# Altium schematic sheet Bluetooth.SchDoc
size A3
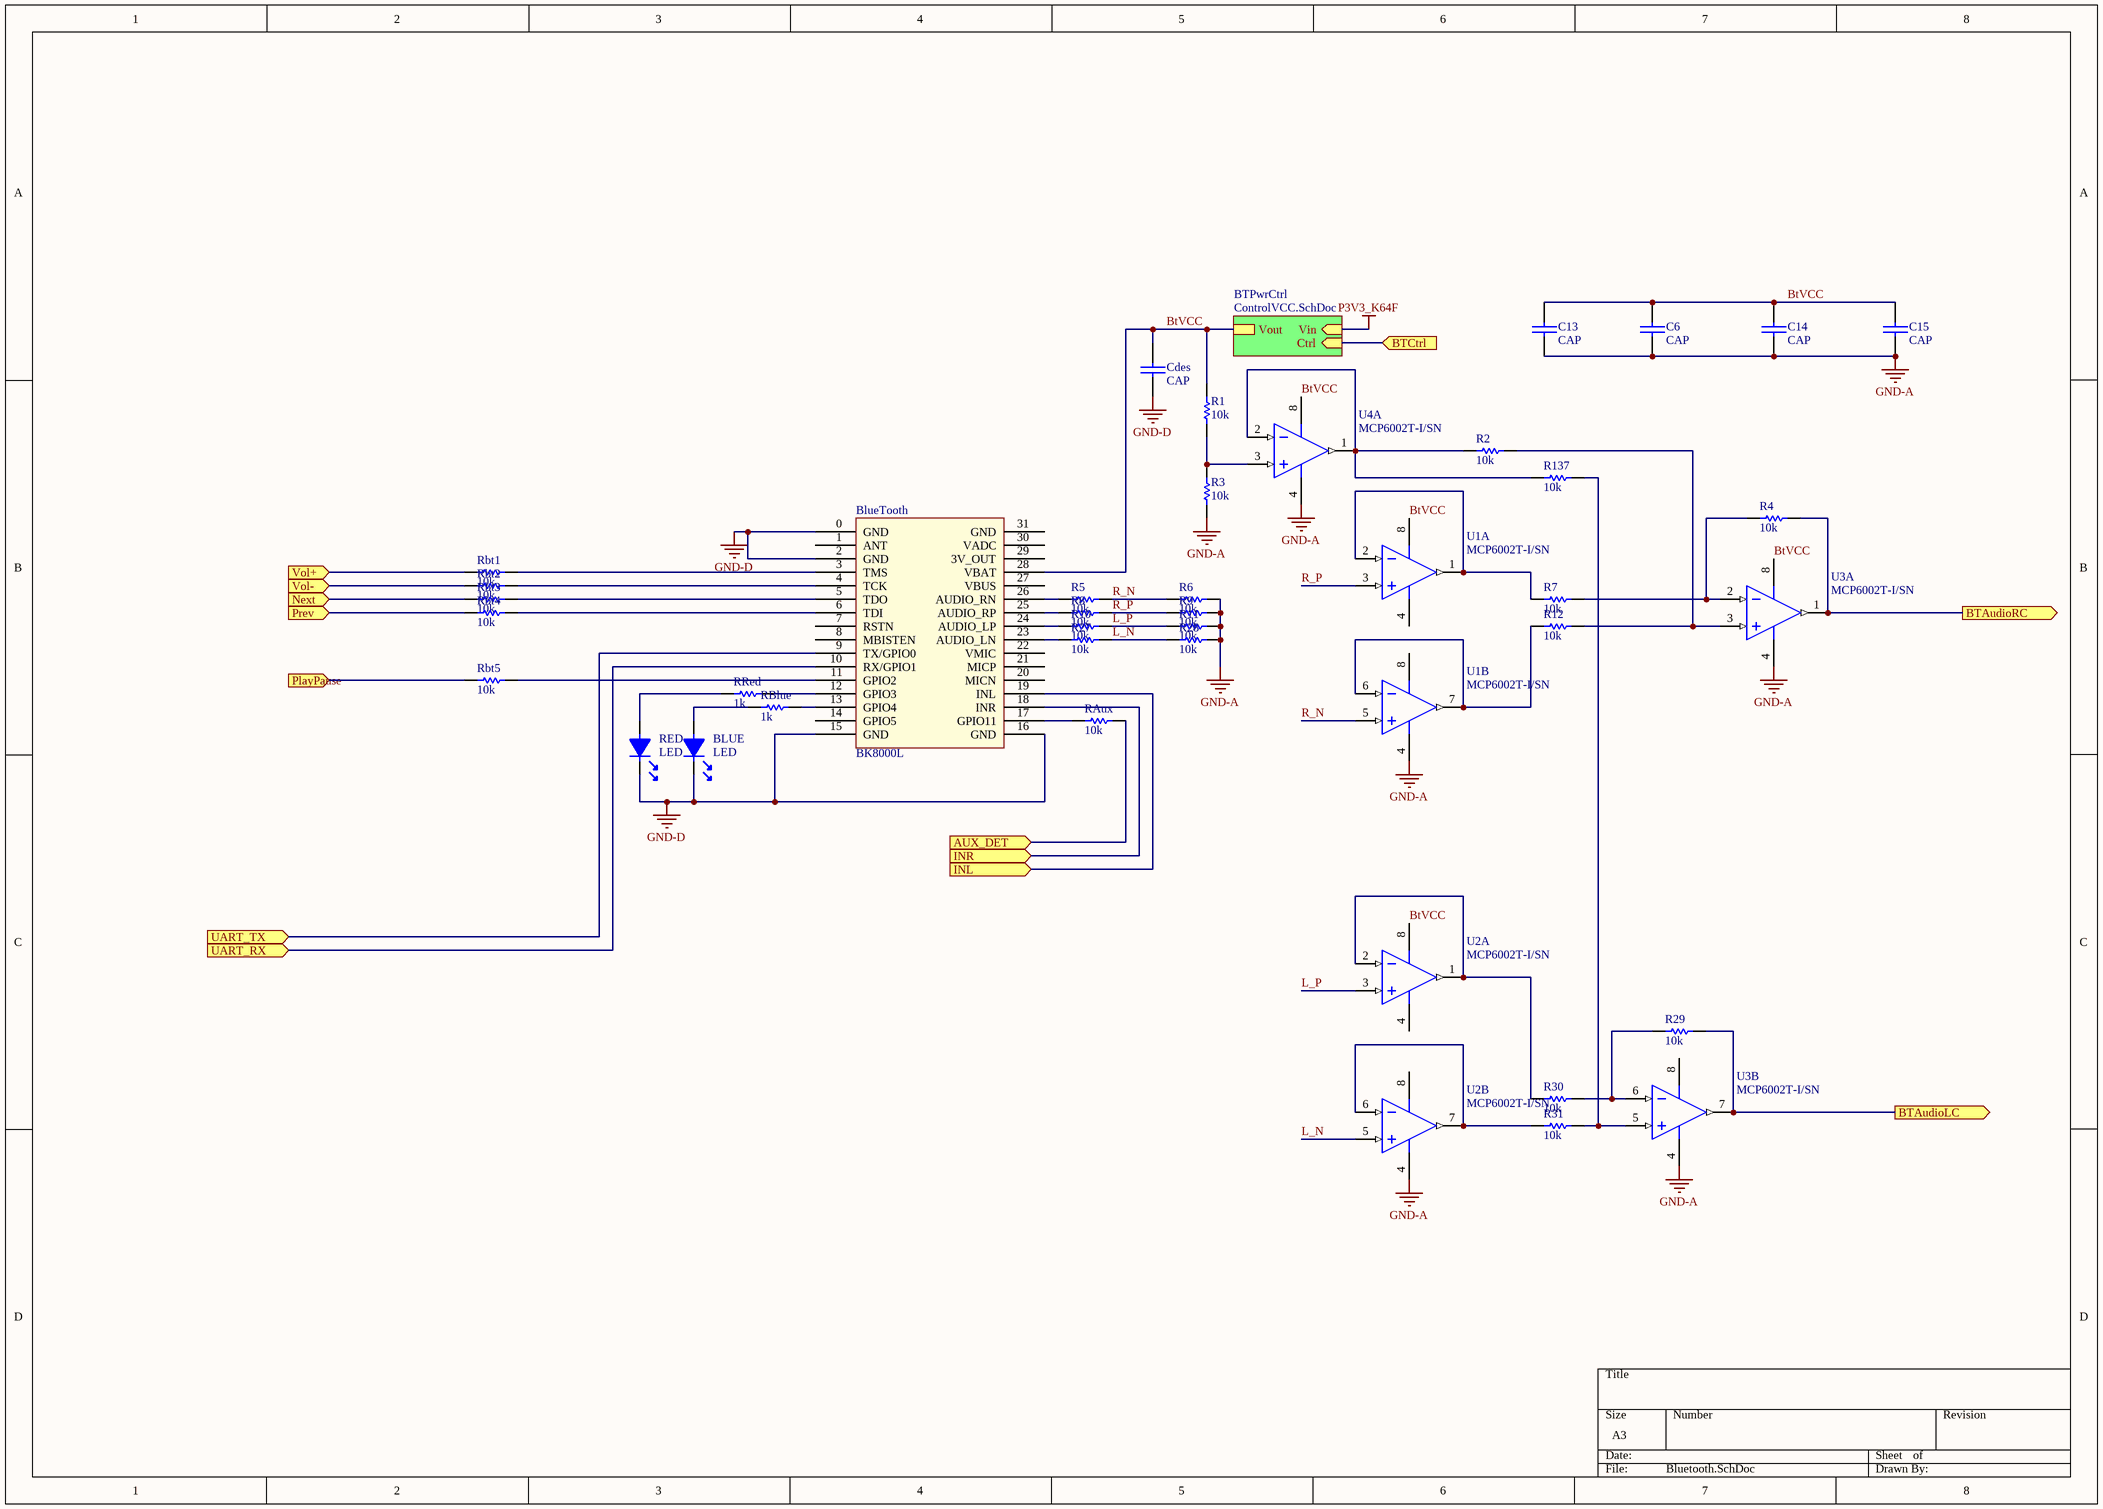
[diagram p0: Bluetooth.SchDoc]

## Parts
BLUE  LED  [0805]
BlueTooth  BK8000L  [BK8000L]
C6  CAP  [0805]
C13  CAP  [0805]
C14  CAP  [0805]
C15  CAP  [0805]
Cdes  CAP  [0805]
R1  10k  [0805]
R2  10k  [0805]
R3  10k  [0805]
R4  10k  [0805]
R5  10k  [0805]
R6  10k  [0805]
R7  10k  [0805]
R8  10k  [0805]
R9  10k  [0805]
R10  10k  [0805]
R11  10k  [0805]
R12  10k  [0805]
R27  10k  [0805]
R28  10k  [0805]
R29  10k  [0805]
R30  10k  [0805]
R31  10k  [0805]
R137  10k  [0805]
RAux  10k  [0805]
RBlue  1k  [0805]
Rbt1  10k  [0805]
Rbt2  10k  [0805]
Rbt3  10k  [0805]
Rbt4  10k  [0805]
Rbt5  10k  [0805]
RED  LED  [0805]
RRed  1k  [0805]
U1  MCP6002T-I/SN  [SOIC-SN8_N]  (parts A,B of 2)
U2  MCP6002T-I/SN  [SOIC-SN8_N]  (parts A,B of 2)
U3  MCP6002T-I/SN  [SOIC-SN8_N]  (parts A,B of 2)
U4  MCP6002T-I/SN  [SOIC-SN8_N]  (part A of 2)

## Sub-sheets
BTPwrCtrl = ControlVCC.SchDoc: Vin (in), Vout, Ctrl (in)

## Ports
AUX_DET (in), BTAudioLC (out), BTAudioRC (out), BTCtrl (in), INL (in), INR (in), Next (in), PlayPause (in), Prev (in), UART_RX (in), UART_TX (in), Vol+ (in), Vol- (in)

## Nets
GND-A: C6.2 C13.2 C14.2 C15.2 R3.1 R6.2 R9.2 R11.2 R28.2 U1.4(VSS) U2.4(VSS) U3.4(VSS) U4.4(VSS)
GND-D: BLUE.2 BlueTooth.0(GND) BlueTooth.2(GND) BlueTooth.15(GND) BlueTooth.16(GND) Cdes.2 RED.2
P3V3_K64F: sheet BTPwrCtrl/Vin
AUX_DET: RAux.2 ; port AUX_DET
BTAudioLC: R29.2 U3.7(VOUTB) ; port BTAudioLC
BTAudioRC: R4.2 U3.1(VOUTA) ; port BTAudioRC
BTCtrl: port BTCtrl, sheet BTPwrCtrl/Ctrl
BtVCC: BlueTooth.28(VBAT) C6.1 C13.1 C14.1 C15.1 Cdes.1 R1.2 U1.8(VDD) U2.8(VDD) U3.8(VDD) U4.8(VDD) ; sheet BTPwrCtrl/Vout
INL: BlueTooth.19(INL) ; port INL
INR: BlueTooth.18(INR) ; port INR
L_N: R27.2 R28.1 U2.5(VINB+)
L_P: R10.2 R11.1 U2.3(VINA+)
Next: Rbt3.1 ; port Next
PlayPause: Rbt5.1 ; port PlayPause
Prev: Rbt4.1 ; port Prev
R_N: R5.2 R6.1 U1.5(VINB+)
R_P: R8.2 R9.1 U1.3(VINA+)
UART_RX: BlueTooth.10(RX/GPIO1) ; port UART_RX
UART_TX: BlueTooth.9(TX/GPIO0) ; port UART_TX
Vol+: Rbt1.1 ; port Vol+
Vol-: Rbt2.1 ; port Vol-
NetBLUE_1: BLUE.1 RBlue.1
NetBlueTooth_3: BlueTooth.3(TMS) Rbt1.2
NetBlueTooth_4: BlueTooth.4(TCK) Rbt2.2
NetBlueTooth_5: BlueTooth.5(TDO) Rbt3.2
NetBlueTooth_6: BlueTooth.6(TDI) Rbt4.2
NetBlueTooth_11: BlueTooth.11(GPIO2) Rbt5.2
NetBlueTooth_12: BlueTooth.12(GPIO3) RRed.2
NetBlueTooth_13: BlueTooth.13(GPIO4) RBlue.2
NetBlueTooth_17: BlueTooth.17(GPIO11) RAux.1
NetBlueTooth_23: BlueTooth.23(AUDIO_LN) R27.1
NetBlueTooth_24: BlueTooth.24(AUDIO_LP) R10.1
NetBlueTooth_25: BlueTooth.25(AUDIO_RP) R8.1
NetBlueTooth_26: BlueTooth.26(AUDIO_RN) R5.1
NetR1_1: R1.1 R3.2 U4.3(VINA+)
NetR2_1: R2.1 R137.1 U4.1(VOUTA) U4.2(VINA-)
NetR2_2: R2.2 R12.2 U3.3(VINA+)
NetR4_1: R4.1 R7.2 U3.2(VINA-)
NetR7_1: R7.1 U1.1(VOUTA) U1.2(VINA-)
NetR12_1: R12.1 U1.6(VINB-) U1.7(VOUTB)
NetR29_1: R29.1 R30.2 U3.6(VINB-)
NetR30_1: R30.1 U2.1(VOUTA) U2.2(VINA-)
NetR31_1: R31.1 U2.6(VINB-) U2.7(VOUTB)
NetR31_2: R31.2 R137.2 U3.5(VINB+)
NetRED_1: RED.1 RRed.1

Not connected (* = marked no-connect by the designer): BlueTooth 1(ANT) 7(RSTN) 8(MBISTEN) 14(GPIO5) 20(MICN) 21(MICP) 22(VMIC) 27(VBUS) 29(3V_OUT) 30(VADC) 31(GND)

## Library data of the parts
R1-R12 R27-R31 R137 RAux RBlue Rbt1-Rbt5 RRed = RES
U1-U4 = MCP6002T-I/SN: 1 MHz, Low-Power Operational Amplifier, 8-Pin SOIC, Industrial Temperature, Tape and Reel; Published: 29-Jan-2009; LatestRevisionDate: 02-Dec-2009; LatestRevisionNote: Updated to datasheet revision J, Nov-2009; DatasheetVersion: revJ, Nov-2009; PackageVersion: revBB, Aug-2009; PackageReference: SOIC-SN8; Publisher: Altium Limited; PackageDescription: 8-Lead Plastic Small Outline (SN) - Narrow, 3.90mm Body [SOIC]; Supplier 1: Digi-Key; Supplier Part Number 1: MCP6002T-I/SN-ND; Code_JEDEC: MS-012; Code_IPC: SOIC127P600-8; ComponentLink1Description: Datasheet; ComponentLink1URL: http://ww1.microchip.com/downloads/en/DeviceDoc/21733j.pdf; ComponentLink2Description: Packaging Specification; ComponentLink2URL: http://www.microchip.com/stellent/groups/techpub_sg/documents/packagingspec/en012702.pdf; ComponentLink3Description: Microchip.com Home; ComponentLink3URL: http://www.microchip.com/